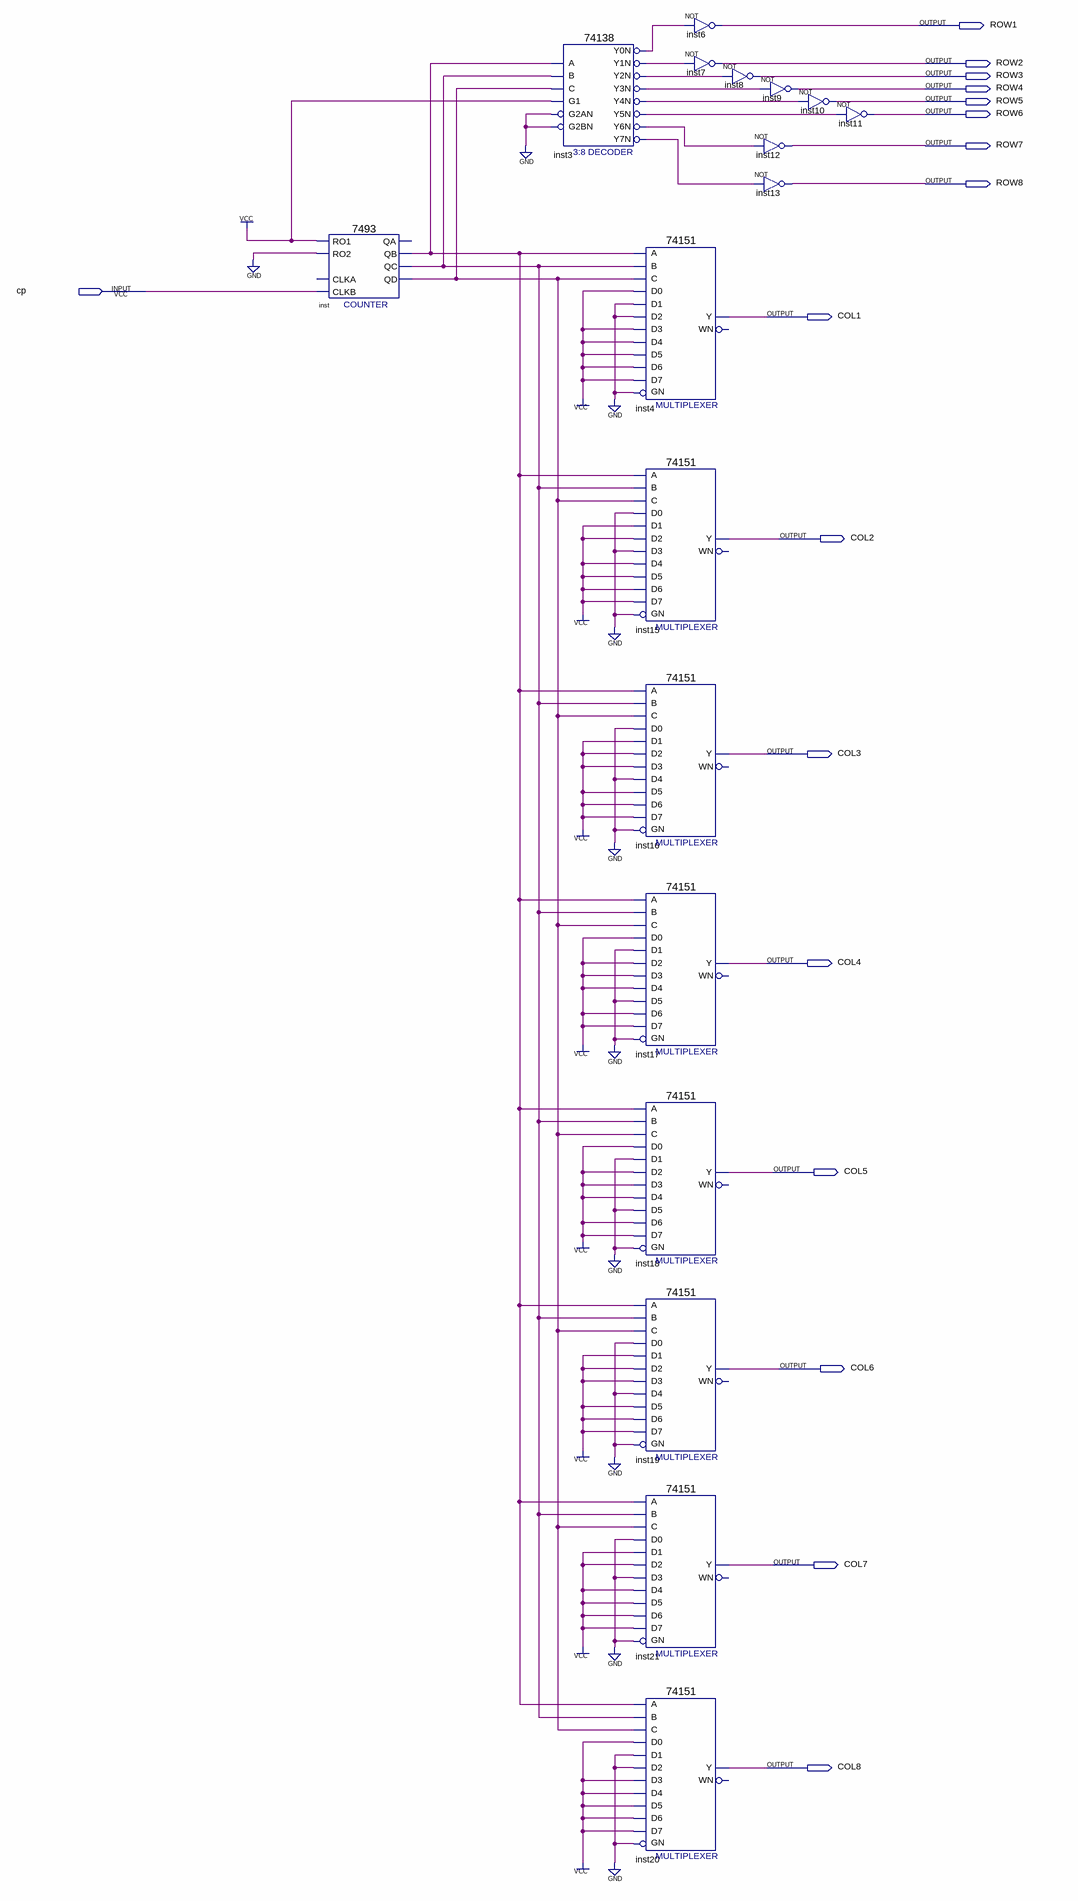
[diagram p0: schematic sheet]
// Quartus schematic JUZHEN.bdf as structural Verilog: 18 symbols, 17 pins
module JUZHEN (
  input  cp,
  output ROW1,
  output ROW2,
  output ROW3,
  output ROW4,
  output ROW5,
  output ROW6,
  output ROW7,
  output ROW8,
  output COL1,
  output COL2,
  output COL3,
  output COL4,
  output COL5,
  output COL6,
  output COL7,
  output COL8
);

  wire inst3_y0n, inst3_y1n, inst3_y2n, inst3_y3n, inst3_y4n, inst3_y5n, inst3_y6n, inst3_y7n, inst_qb,
       inst_qc, inst_qd;

  \7493  inst (.RO1(1'b1), .RO2(1'b0), .CLKB(cp), .QC(inst_qc), .QB(inst_qb), .QD(inst_qd));  // open: CLKA, QA
  \74138  inst3 (
    .A(inst_qb), .B(inst_qc), .G1(1'b1), .C(inst_qd), .G2AN(1'b0), .G2BN(1'b0), .Y0N(inst3_y0n),
    .Y1N(inst3_y1n), .Y2N(inst3_y2n), .Y3N(inst3_y3n), .Y4N(inst3_y4n), .Y5N(inst3_y5n), .Y6N(inst3_y6n),
    .Y7N(inst3_y7n));
  \74151  inst4 (
    .GN(1'b0), .C(inst_qd), .B(inst_qc), .A(inst_qb), .D5(1'b1), .D0(1'b1), .D1(1'b0), .D4(1'b1), .D3(1'b1),
    .D2(1'b0), .D6(1'b1), .D7(1'b1), .Y(COL1));  // open: WN
  \74151  inst15 (
    .GN(1'b0), .C(inst_qd), .B(inst_qc), .A(inst_qb), .D5(1'b1), .D0(1'b0), .D1(1'b1), .D4(1'b1), .D3(1'b0),
    .D2(1'b1), .D6(1'b1), .D7(1'b1), .Y(COL2));  // open: WN
  \74151  inst16 (
    .GN(1'b0), .C(inst_qd), .B(inst_qc), .A(inst_qb), .D5(1'b1), .D0(1'b0), .D1(1'b1), .D4(1'b0), .D3(1'b1),
    .D2(1'b1), .D6(1'b1), .D7(1'b1), .Y(COL3));  // open: WN
  \74151  inst17 (
    .GN(1'b0), .C(inst_qd), .B(inst_qc), .A(inst_qb), .D5(1'b0), .D0(1'b1), .D1(1'b0), .D4(1'b1), .D3(1'b1),
    .D2(1'b1), .D6(1'b1), .D7(1'b1), .Y(COL4));  // open: WN
  \74151  inst18 (
    .GN(1'b0), .C(inst_qd), .B(inst_qc), .A(inst_qb), .D5(1'b0), .D0(1'b1), .D1(1'b0), .D4(1'b1), .D3(1'b1),
    .D2(1'b1), .D6(1'b1), .D7(1'b1), .Y(COL5));  // open: WN
  \74151  inst19 (
    .GN(1'b0), .C(inst_qd), .B(inst_qc), .A(inst_qb), .D5(1'b1), .D0(1'b0), .D1(1'b1), .D4(1'b0), .D3(1'b1),
    .D2(1'b1), .D6(1'b1), .D7(1'b1), .Y(COL6));  // open: WN
  \74151  inst21 (
    .GN(1'b0), .C(inst_qd), .B(inst_qc), .A(inst_qb), .D5(1'b1), .D0(1'b0), .D1(1'b1), .D4(1'b1), .D3(1'b0),
    .D2(1'b1), .D6(1'b1), .D7(1'b1), .Y(COL7));  // open: WN
  \74151  inst20 (
    .GN(1'b0), .C(inst_qd), .B(inst_qc), .A(inst_qb), .D5(1'b1), .D0(1'b1), .D1(1'b0), .D4(1'b1), .D3(1'b1),
    .D2(1'b0), .D6(1'b1), .D7(1'b1), .Y(COL8));  // open: WN
  not inst6 (ROW1, inst3_y0n);
  not inst7 (ROW2, inst3_y1n);
  not inst8 (ROW3, inst3_y2n);
  not inst9 (ROW4, inst3_y3n);
  not inst12 (ROW7, inst3_y6n);
  not inst13 (ROW8, inst3_y7n);
  not inst10 (ROW5, inst3_y4n);
  not inst11 (ROW6, inst3_y5n);
endmodule
